# Altium schematic sheet bb header.SchDoc
size A4
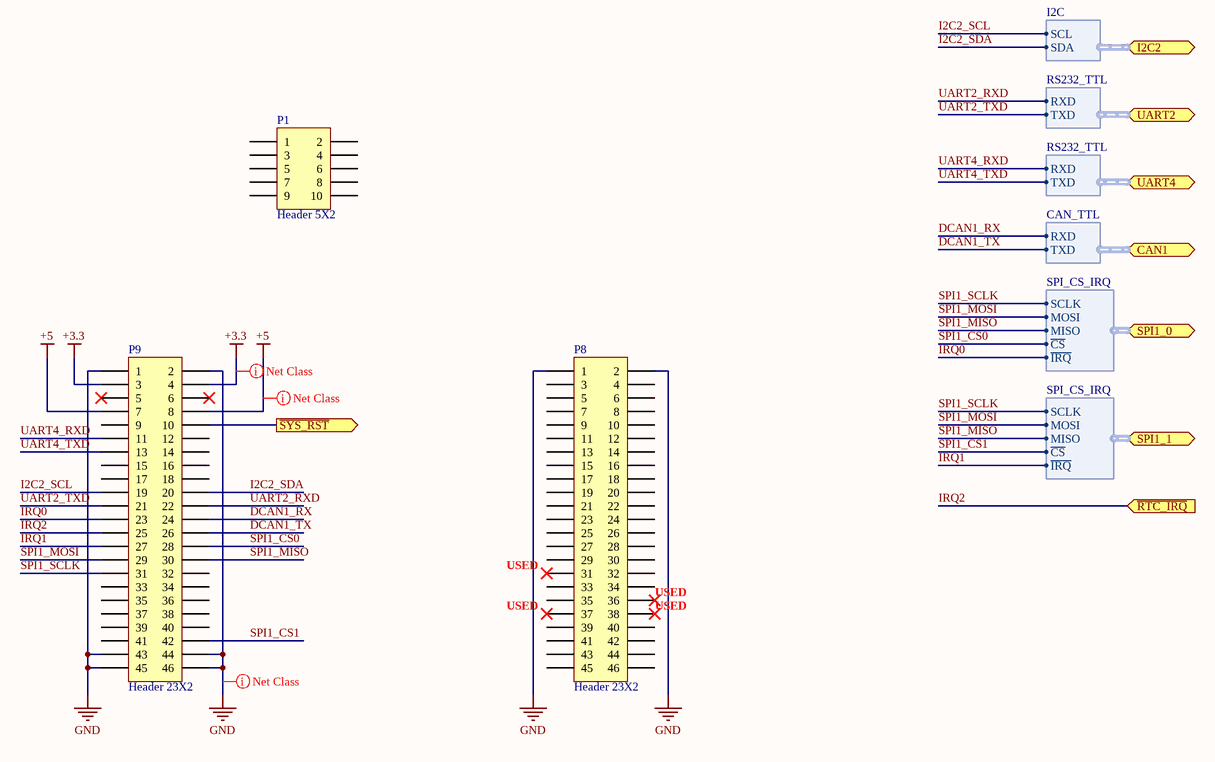
[diagram p0: bb header.SchDoc]

## Parts
P1  Header 5X2  [TSW-105-07-T-D_DOWN]
P8  Header 23X2  [TSW-123-07-T-D_DOWN]
P9  Header 23X2  [TSW-123-07-T-D_DOWN]

## Ports
CAN1 (harness CAN_TTL), I2C2 (harness I2C), SPI1_0 (harness SPI_CS_IRQ), SPI1_1 (harness SPI_CS_IRQ), UART2 (harness RS232_TTL), UART4 (harness RS232_TTL), ~{RTC_IRQ} (in), ~{SYS_RST} (out)

## Harnesses
I2C: SCL, SDA
RS232_TTL: RXD, TXD
CAN_TTL: TXD, RXD
SPI_CS_IRQ: SCLK, MOSI, MISO, ~{CS}, ~{IRQ}

## Nets
+3.3: P9.3 P9.4
+5: P9.7 P9.8
GND: P8.1 P8.2 P9.1 P9.2 P9.43 P9.44 P9.45 P9.46
DCAN1_RX: P9.24 ; port CAN1.RXD
DCAN1_TX: P9.26 ; port CAN1.TXD
I2C2_SCL: P9.19 ; port I2C2.SCL
I2C2_SDA: P9.20 ; port I2C2.SDA
IRQ0: P9.23 ; port SPI1_0.~{IRQ}
IRQ1: P9.27 ; port SPI1_1.~{IRQ}
IRQ2: P9.25 ; port ~{RTC_IRQ}
~{SYS_RST}: P9.10 ; port ~{SYS_RST}
SPI1_CS0: P9.28 ; port SPI1_0.~{CS}
SPI1_CS1: P9.42 ; port SPI1_1.~{CS}
SPI1_MISO: P9.30 ; port SPI1_0.MISO, port SPI1_1.MISO
SPI1_MOSI: P9.29 ; port SPI1_0.MOSI, port SPI1_1.MOSI
SPI1_SCLK: P9.31 ; port SPI1_0.SCLK, port SPI1_1.SCLK
UART2_RXD: P9.22 ; port UART2.RXD
UART2_TXD: P9.21 ; port UART2.TXD
UART4_RXD: P9.11 ; port UART4.RXD
UART4_TXD: P9.13 ; port UART4.TXD

Not connected (* = marked no-connect by the designer): P1 1 2 3 4 5 6 7 8 9 10; P8 3 4 5 6 7 8 9 10 11 12 13 14 15 16 17 18 19 20 21 22 23 24 25 26 27 28 29 30 31* 32 33 34 35 36* 37* 38* 39 40 41 42 43 44 45 46; P9 5* 6* 9 12 14 15 16 17 18 32 33 34 35 36 37 38 39 40 41

## Layout directives
net class Power: +3.3, +5, GND

## Notes on the sheet
- (near P8) USED

## Library data of the parts
P1 = Header 5X2: Header, 5-Pin, Dual row; LatestRevisionDate: 17-Jul-2002; LatestRevisionNote: Re-released for DXP Platform.; Publisher: Altium Limited; digikey: SAM1204-05-ND; farnell: 2025411
P8 P9 = Header 23X2: Header, 23-Pin, Dual row; LatestRevisionDate: 17-Jul-2002; LatestRevisionNote: Re-released for DXP Platform.; Publisher: Altium Limited; farnell: 2025431; digikey: SAM1204-23-ND